# Altium project PCB_Project.PrjPcb
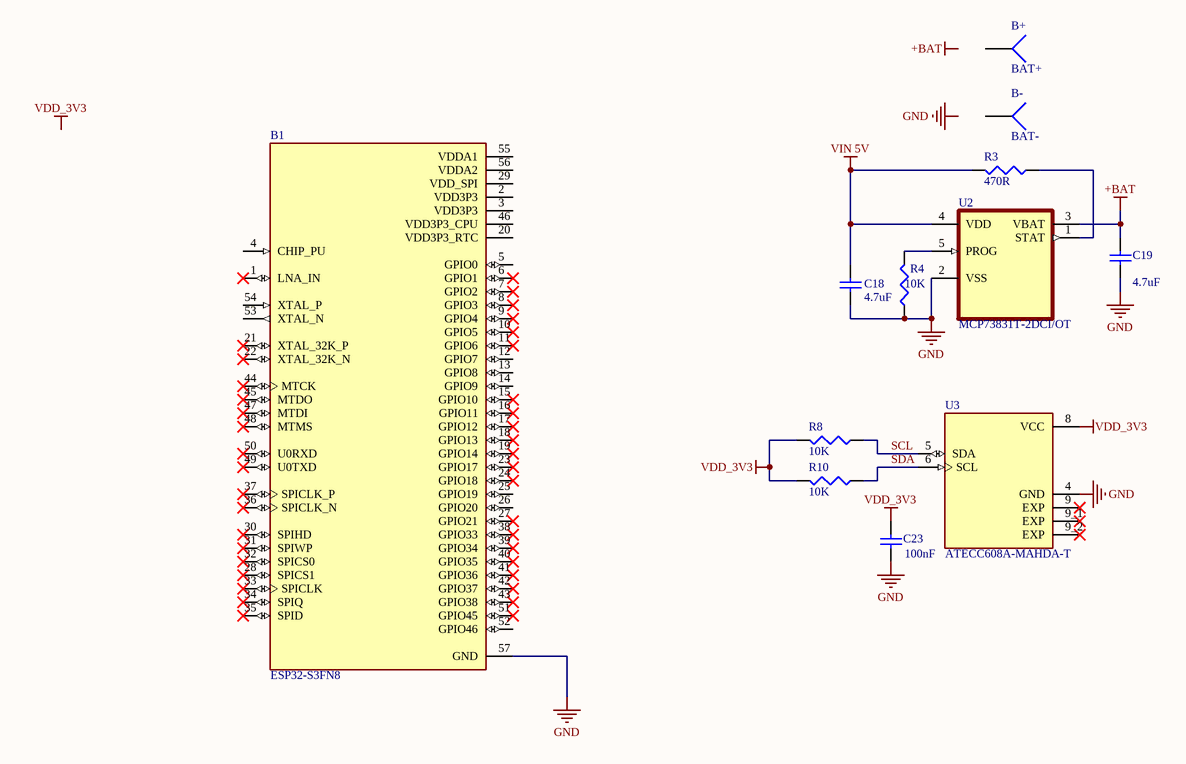
[diagram p0: Sheet1.SchDoc]
1 sheet, 12 parts. Net scope: global (net labels, ports and power ports of the same name join across sheets).

## Sheet Sheet1.SchDoc
size A0; SheetNumber: 1; SheetTotal: 1; SPICEModelCacheCFALFSNT: <root> / <DocumentId>CFALFSNT</DocumentId> / <CacheFrame Number="0"> / <Model Name="cap" Kind="MDL"> / <Text>*Default semiconductor capacitor / .MODEL CAP C()</Text> / </Model> / </CacheFrame> / </root>

### Parts
B1  ESP32-S3FN8  [QFN40P700X700X90-57N]
B+  BAT+  [PIN1]
B-  BAT-  [PIN1]
C18  value 4.7uF  [C1206]  (hidden comment: Cap Semi)
C19  value 4.7uF  [C1206]  (hidden comment: Cap Semi)
C23  value 100nF  [C1206]  (hidden comment: Cap Semi)
R3  value 470R  [J1-0603]  (hidden comment: Res3)
R4  value 10K  [J1-0603]  (hidden comment: Res3)
R8  value 10K  [J1-0603]  (hidden comment: Res3)
R10  value 10K  [J1-0603]  (hidden comment: Res3)
U2  MCP73831T-2DCI/OT  [SOT95P270X145-5N]
U3  ATECC608A-MAHDA-T  [SON50P200X300X60-9N]

### Nets
+BAT: C19.2 U2.3(VBAT)
GND: B1.57(GND) C18.1 C19.1 C23.1 R4.1 U2.2(VSS) U3.4(GND)
VDD_3V3: C23.2 R8.2 R10.2 U3.8(VCC)
VIN 5V: C18.2 R3.2 U2.4(VDD)
SCL: R8.1 U3.5(SDA)
SDA: R10.1 U3.6(SCL)
NetR3_1: R3.1 U2.1(STAT)
NetR4_2: R4.2 U2.5(PROG)

Not connected (* = marked no-connect by the designer): B1 1(LNA_IN)* 2(VDD3P3) 3(VDD3P3) 4(CHIP_PU) 5(GPIO0) 6(GPIO1)* 7(GPIO2)* 8(GPIO3)* 9(GPIO4)* 10(GPIO5)* 11(GPIO6)* 12(GPIO7) 13(GPIO8) 14(GPIO9) 15(GPIO10)* 16(GPIO11)* 17(GPIO12)* 18(GPIO13)* 19(GPIO14)* 20(VDD3P3_RTC) 21(XTAL_32K_P)* 22(XTAL_32K_N)* 23(GPIO17)* 24(GPIO18)* 25(GPIO19) 26(GPIO20) 27(GPIO21)* 28(SPICS1)* 29(VDD_SPI) 30(SPIHD)* 31(SPIWP)* 32(SPICS0)* 33(SPICLK)* 34(SPIQ)* 35(SPID)* 36(SPICLK_N)* 37(SPICLK_P)* 38(GPIO33)* 39(GPIO34)* 40(GPIO35)* 41(GPIO36)* 42(GPIO37)* 43(GPIO38)* 44(MTCK)* 45(MTDO)* 46(VDD3P3_CPU) 47(MTDI)* 48(MTMS)* 49(U0TXD)* 50(U0RXD)* 51(GPIO45)* 52(GPIO46) 53(XTAL_N) 54(XTAL_P) 55(VDDA1) 56(VDDA2); B+ 1; B- 1; U3 9(EXP)* 9_1(EXP)* 9_2(EXP)*

### Notes on the sheet
- Labels drawn without touching a wire or pin: +BAT, GND, VDD_3V3

### Library data of the parts
B1 = ESP32-S3FN8: <a href="https://pricing.snapeda.com/parts/ESP32-S3FN8/Espressif%20Systems/view-part?ref=eda">Check availability</a> <a href="https://pricing.snapeda.com/parts/ESP32-S3FN8/Espressif%20Systems/view-part?ref=eda">Check availability</a>; MF: {'manufacturer': u'Espressif Systems'}; Package: None; Price: None; Value: *; MP: ESP32-S3FN8; Availability: Unavailable
B+ B- = Socket: LatestRevisionDate: 17-Jul-2002; LatestRevisionNote: Re-released for DXP Platform.; Publisher: Altium Limited
C18 C19 C23 = Cap Semi: Capacitor (Semiconductor SIM Model); Published: 8-Jun-2000; LatestRevisionDate: 29-May-2009; LatestRevisionNote: IPC-7351 Footprint Added.; PackageReference: C1206; Publisher: Altium Limited; PackageDescription: Chip Capacitor
R3 R4 R8 R10 = Res3: Resistor; Published: 8-Jun-2000; LatestRevisionDate: 29-May-2009; LatestRevisionNote: IPC-7351 Footprint Added.; PackageReference: J1-0603; Publisher: Altium Limited; PackageDescription: Chip Resistor
U2 = MCP73831T-2DCI/OT: Li-Polymer Charge Management Controllers, SOT23-5; MF: {'manufacturer': u'Microchip'}; MP: MCP73831T-2DCI-OT; Package: None; Price: None; Value: *; Availability: Unavailable
U3 = ATECC608A-MAHDA-T: IC AUTHENTICATION CHIP 8UDFN; MF: {'manufacturer': u'Microchip Technology'}; Package: None; Price: None; Value: *; MP: ATECC608A-MAHDA-T; Availability: Unavailable